# EAGLE schematic boardcaster_pcb (EAGLE 5.07)
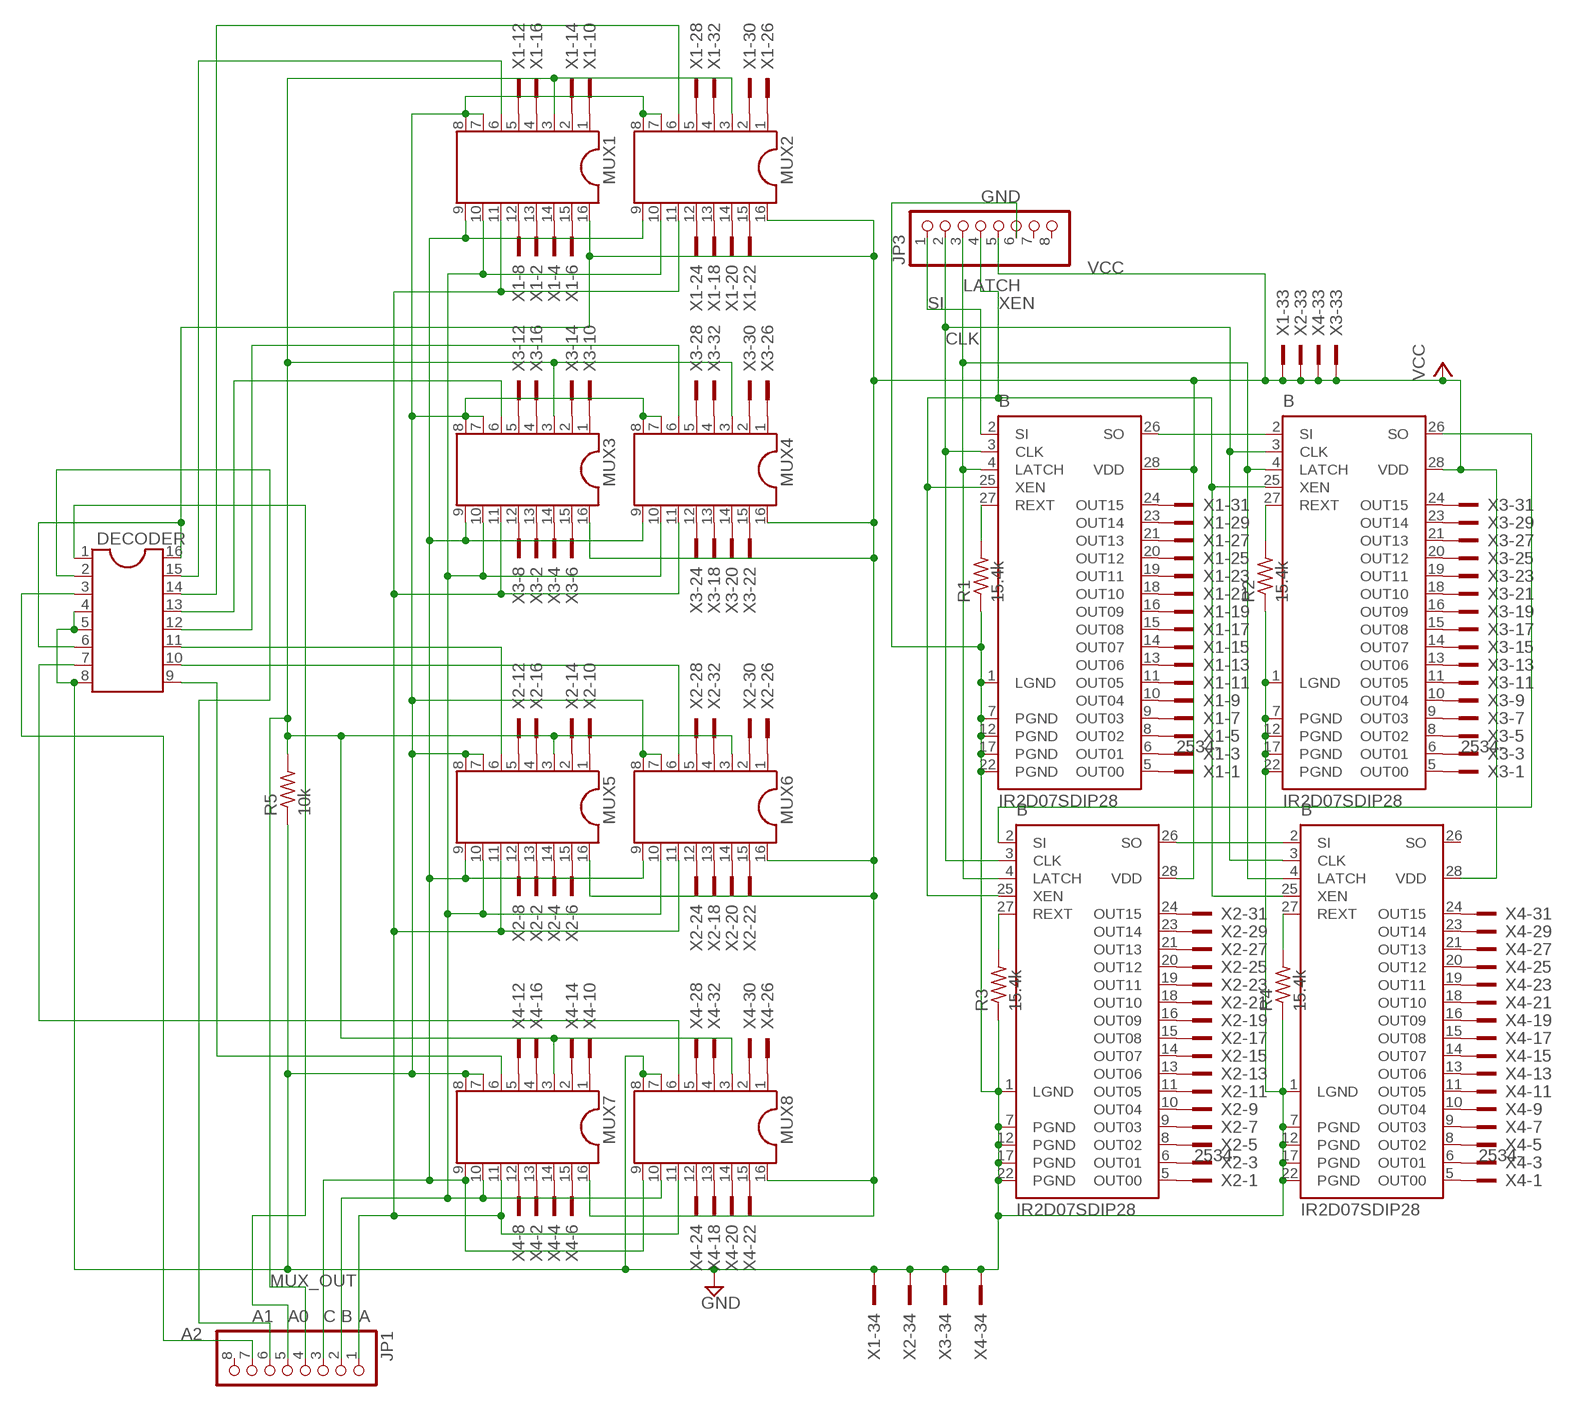
[diagram p0: schematic, sheet 1]

## Parts
DECODER  DIL16  [DIL16]
IC1  IR2D07SDIP28  [SDIP28]
IC2  IR2D07SDIP28  [SDIP28]
IC3  IR2D07SDIP28  [SDIP28]
IC4  IR2D07SDIP28  [SDIP28]
JP1  PINHD-1X8  [1X08]
JP3  PINHD-1X8  [1X08]
MUX1  DIL16  [DIL16]
MUX2  DIL16  [DIL16]
MUX3  DIL16  [DIL16]
MUX4  DIL16  [DIL16]
MUX5  DIL16  [DIL16]
MUX6  DIL16  [DIL16]
MUX7  DIL16  [DIL16]
MUX8  DIL16  [DIL16]
R1  15.4k  R-US_0207/10  [0207/10]
R2  15.4k  R-US_0207/10  [0207/10]
R3  15.4k  R-US_0207/10  [0207/10]
R4  15.4k  R-US_0207/10  [0207/10]
R5  10k  R-US_0207/10  [0207/10]
X1  2534-  [PAK100/2500-34]
X2  2534-  [PAK100/2500-34]
X3  2534-  [PAK100/2500-34]
X4  2534-  [PAK100/2500-34]

## Nets
A: JP1.1 MUX1.11 MUX2.11 MUX3.11 MUX4.11 MUX5.11 MUX6.11 MUX7.11 MUX8.11
A0: DECODER.1 JP1.5
A1: DECODER.2 JP1.6
A2: DECODER.3 JP1.7
B: JP1.2 MUX1.10 MUX2.10 MUX3.10 MUX4.10 MUX5.10 MUX6.10 MUX7.10 MUX8.10
C: JP1.3 MUX1.9 MUX2.9 MUX3.9 MUX4.9 MUX5.9 MUX6.9 MUX7.9 MUX8.9
CLK: IC1.3(CLK) IC2.3(CLK) IC3.3(CLK) IC4.3(CLK) JP3.2
GND: DECODER.4 DECODER.5 DECODER.8 IC1.1(LGND) IC1.7(PGND) IC1.12(PGND) IC1.17(PGND) IC1.22(PGND) IC2.1(LGND) IC2.7(PGND) IC2.12(PGND) IC2.17(PGND) IC2.22(PGND) IC3.1(LGND) IC3.7(PGND) IC3.12(PGND) IC3.17(PGND) IC3.22(PGND) IC4.1(LGND) IC4.7(PGND) IC4.12(PGND) IC4.17(PGND) IC4.22(PGND) JP3.6 MUX1.7 MUX1.8 MUX2.7 MUX2.8 MUX3.7 MUX3.8 MUX4.7 MUX4.8 MUX5.7 MUX5.8 MUX6.7 MUX6.8 MUX7.7 MUX7.8 MUX8.7 MUX8.8 R1.1 R2.1 R3.1 R4.1 R5.1 X1.34 X2.34 X3.34 X4.34
LATCH: IC1.4(LATCH) IC2.4(LATCH) IC3.4(LATCH) IC4.4(LATCH) JP3.3
MUX_OUT: JP1.4 MUX1.3 MUX2.3 MUX3.3 MUX4.3 MUX5.3 MUX6.3 MUX7.3 MUX8.3 R5.2
N$2: IC1.27(REXT) R1.2
N$3: IC3.27(REXT) R2.2
N$4: IC1.26(SO) IC3.2(SI)
N$5: IC2.26(SO) IC4.2(SI)
N$7: IC2.2(SI) IC3.26(SO)
N$8: MUX7.5 X4.12
N$10: MUX7.4 X4.16
N$11: IC2.27(REXT) R3.2
N$12: IC4.27(REXT) R4.2
N$14: MUX7.2 X4.14
N$15: MUX7.1 X4.10
N$23: DECODER.15 MUX1.6
N$24: DECODER.14 MUX2.6
N$25: DECODER.13 MUX3.6
N$26: IC2.14(OUT07) X2.15
N$27: DECODER.12 MUX4.6
N$28: MUX5.14 X2.4
N$29: DECODER.11 MUX5.6
N$30: DECODER.10 MUX6.6
N$31: DECODER.9 MUX7.6
N$32: DECODER.7 MUX8.6
N$38: IC2.15(OUT08) X2.17
N$39: IC1.5(OUT00) X1.1
N$40: IC1.6(OUT01) X1.3
N$41: IC1.8(OUT02) X1.5
N$42: IC1.9(OUT03) X1.7
N$43: IC1.10(OUT04) X1.9
N$44: IC1.11(OUT05) X1.11
N$45: IC1.13(OUT06) X1.13
N$46: IC1.14(OUT07) X1.15
N$47: IC1.15(OUT08) X1.17
N$48: IC1.16(OUT09) X1.19
N$49: IC1.18(OUT10) X1.21
N$50: IC1.19(OUT11) X1.23
N$51: IC1.20(OUT12) X1.25
N$52: IC1.21(OUT13) X1.27
N$53: IC1.23(OUT14) X1.29
N$54: IC1.24(OUT15) X1.31
N$55: IC3.5(OUT00) X3.1
N$56: IC3.6(OUT01) X3.3
N$57: IC3.8(OUT02) X3.5
N$58: IC3.9(OUT03) X3.7
N$59: IC3.10(OUT04) X3.9
N$60: IC3.11(OUT05) X3.11
N$61: IC3.13(OUT06) X3.13
N$62: IC3.14(OUT07) X3.15
N$63: IC3.15(OUT08) X3.17
N$64: IC3.16(OUT09) X3.19
N$65: IC3.18(OUT10) X3.21
N$66: IC3.19(OUT11) X3.23
N$67: IC3.20(OUT12) X3.25
N$68: IC3.21(OUT13) X3.27
N$69: IC3.23(OUT14) X3.29
N$70: IC3.24(OUT15) X3.31
N$71: IC2.5(OUT00) X2.1
N$72: IC2.6(OUT01) X2.3
N$73: IC2.8(OUT02) X2.5
N$74: IC2.9(OUT03) X2.7
N$75: IC2.10(OUT04) X2.9
N$76: IC2.11(OUT05) X2.11
N$77: IC2.13(OUT06) X2.13
N$78: IC2.16(OUT09) X2.19
N$79: IC2.18(OUT10) X2.21
N$80: IC2.19(OUT11) X2.23
N$81: IC2.20(OUT12) X2.25
N$82: IC2.21(OUT13) X2.27
N$83: IC2.23(OUT14) X2.29
N$84: IC2.24(OUT15) X2.31
N$85: IC4.5(OUT00) X4.1
N$86: IC4.6(OUT01) X4.3
N$87: IC4.9(OUT03) X4.7
N$88: IC4.8(OUT02) X4.5
N$89: IC4.10(OUT04) X4.9
N$90: IC4.11(OUT05) X4.11
N$91: IC4.13(OUT06) X4.13
N$92: IC4.14(OUT07) X4.15
N$93: IC4.15(OUT08) X4.17
N$94: IC4.16(OUT09) X4.19
N$95: IC4.18(OUT10) X4.21
N$96: IC4.19(OUT11) X4.23
N$97: IC4.20(OUT12) X4.25
N$98: IC4.21(OUT13) X4.27
N$99: IC4.23(OUT14) X4.29
N$100: IC4.24(OUT15) X4.31
N$101: MUX1.13 X1.2
N$102: MUX1.14 X1.4
N$103: MUX1.15 X1.6
N$104: MUX1.12 X1.8
N$105: MUX1.1 X1.10
N$106: MUX1.5 X1.12
N$107: MUX1.2 X1.14
N$108: MUX1.4 X1.16
N$109: MUX2.13 X1.18
N$110: MUX2.14 X1.20
N$111: MUX2.15 X1.22
N$112: MUX2.12 X1.24
N$113: MUX2.1 X1.26
N$114: MUX2.5 X1.28
N$115: MUX2.2 X1.30
N$116: MUX2.4 X1.32
N$117: MUX3.13 X3.2
N$118: MUX3.14 X3.4
N$119: MUX3.15 X3.6
N$120: MUX3.12 X3.8
N$121: MUX3.1 X3.10
N$122: MUX3.5 X3.12
N$123: MUX3.2 X3.14
N$124: MUX3.4 X3.16
N$125: MUX4.13 X3.18
N$126: MUX4.14 X3.20
N$127: MUX4.15 X3.22
N$128: MUX4.12 X3.24
N$129: MUX4.1 X3.26
N$130: MUX4.5 X3.28
N$131: MUX4.2 X3.30
N$132: MUX4.4 X3.32
N$133: MUX7.13 X4.2
N$134: MUX7.14 X4.4
N$135: MUX7.15 X4.6
N$136: MUX7.12 X4.8
N$141: MUX8.13 X4.18
N$142: MUX8.14 X4.20
N$143: MUX8.15 X4.22
N$144: MUX8.12 X4.24
N$145: MUX8.1 X4.26
N$146: MUX8.5 X4.28
N$147: MUX8.2 X4.30
N$148: MUX8.4 X4.32
N$149: MUX5.13 X2.2
N$151: MUX5.15 X2.6
N$152: MUX5.12 X2.8
N$153: MUX5.1 X2.10
N$154: MUX5.5 X2.12
N$155: MUX5.2 X2.14
N$156: MUX5.4 X2.16
N$157: MUX6.13 X2.18
N$158: MUX6.14 X2.20
N$159: MUX6.15 X2.22
N$160: MUX6.12 X2.24
N$161: MUX6.1 X2.26
N$162: MUX6.5 X2.28
N$163: MUX6.2 X2.30
N$164: MUX6.4 X2.32
SI: IC1.2(SI) JP3.1
VCC: DECODER.6 DECODER.16 IC1.28(VDD) IC2.28(VDD) IC3.28(VDD) IC4.28(VDD) JP3.5 MUX1.16 MUX2.16 MUX3.16 MUX4.16 MUX5.16 MUX6.16 MUX7.16 MUX8.16 X1.33 X2.33 X3.33 X4.33
XEN: IC1.25(XEN) IC2.25(XEN) IC3.25(XEN) IC4.25(XEN) JP3.4
Unconnected: IC4.26(SO) JP1.8 JP3.7 JP3.8

## Library data of the parts
DECODER MUX1-MUX8 = ic-package:DIL16: Dual In Line / Socket
IC1-IC4 = ir2d07(2):IR2D07
JP1 JP3 = pinhead:PINHD-1X8: PIN HEADER
R1-R5 = resistor:R-US_: RESISTOR, American symbol
X1-X4 = con-3m:2534-: 3M (TM) Pak 100 4-Wall Header Source: 3M; OC_FARNELL: unknown; OC_NEWARK: unknown